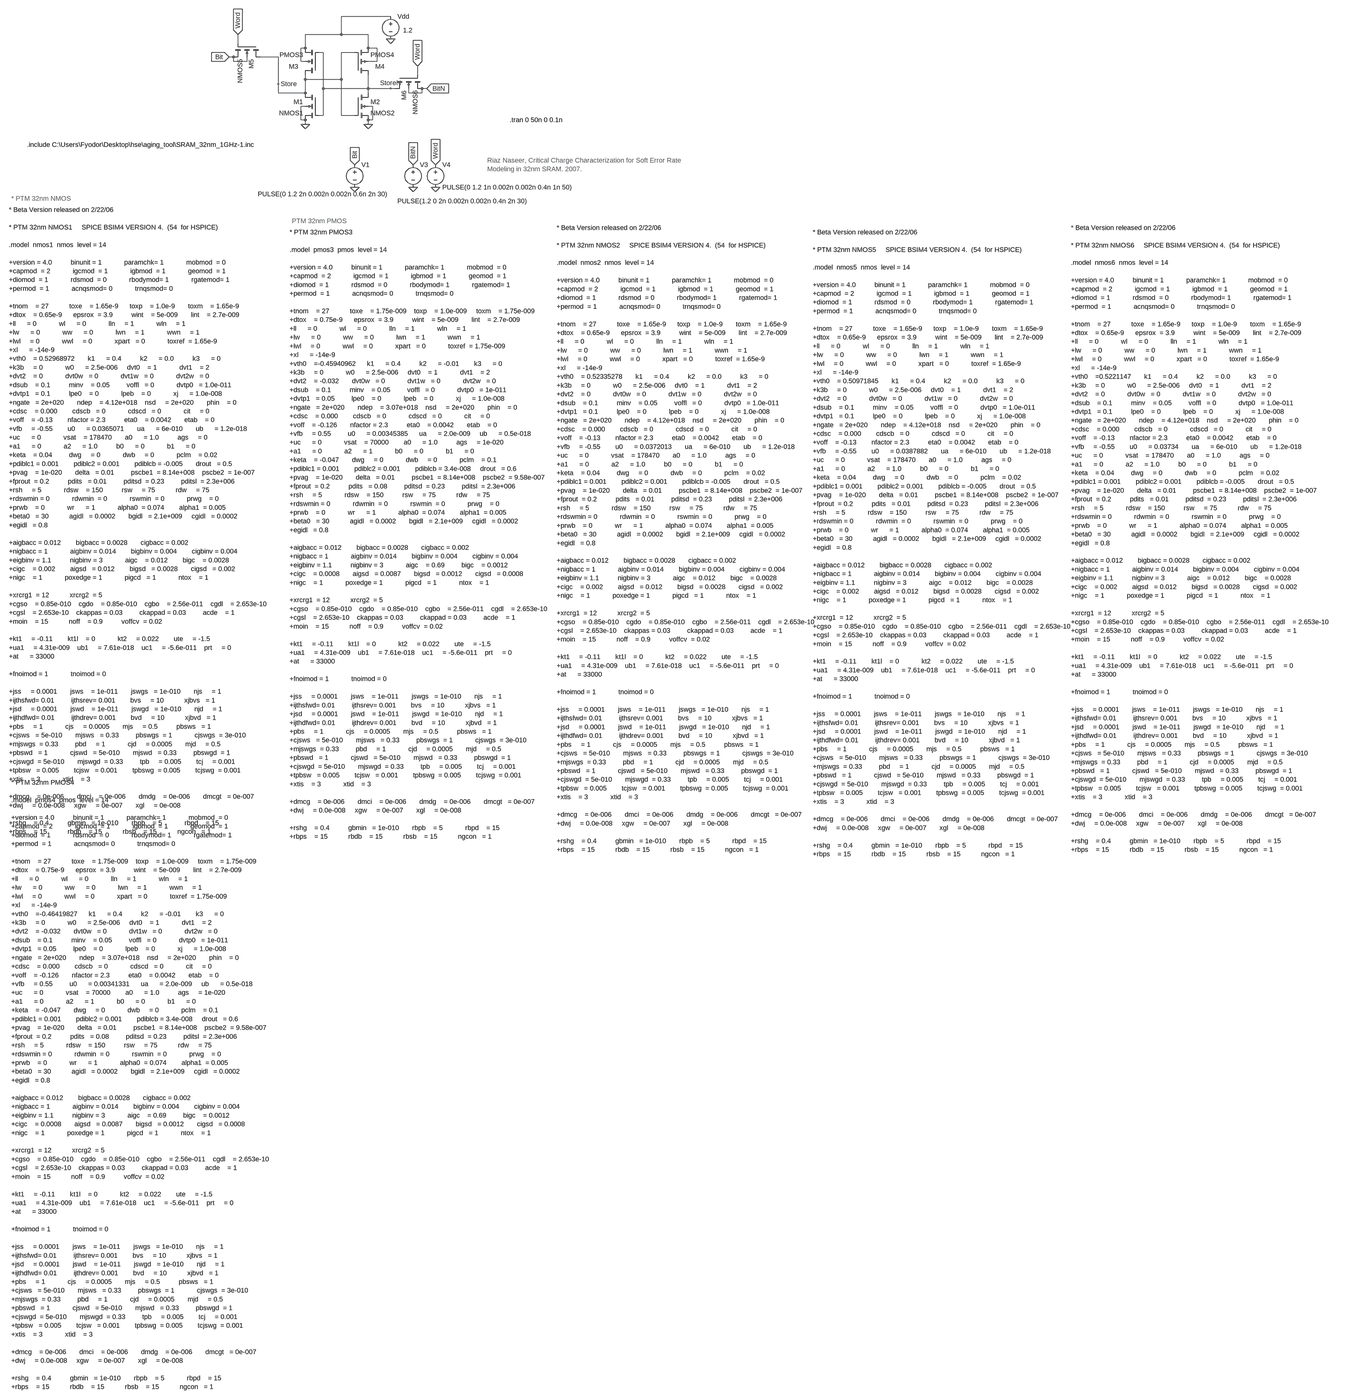
[diagram p0: schematic SRAM_32nm_1GHz_1V.asc, whole sheet]
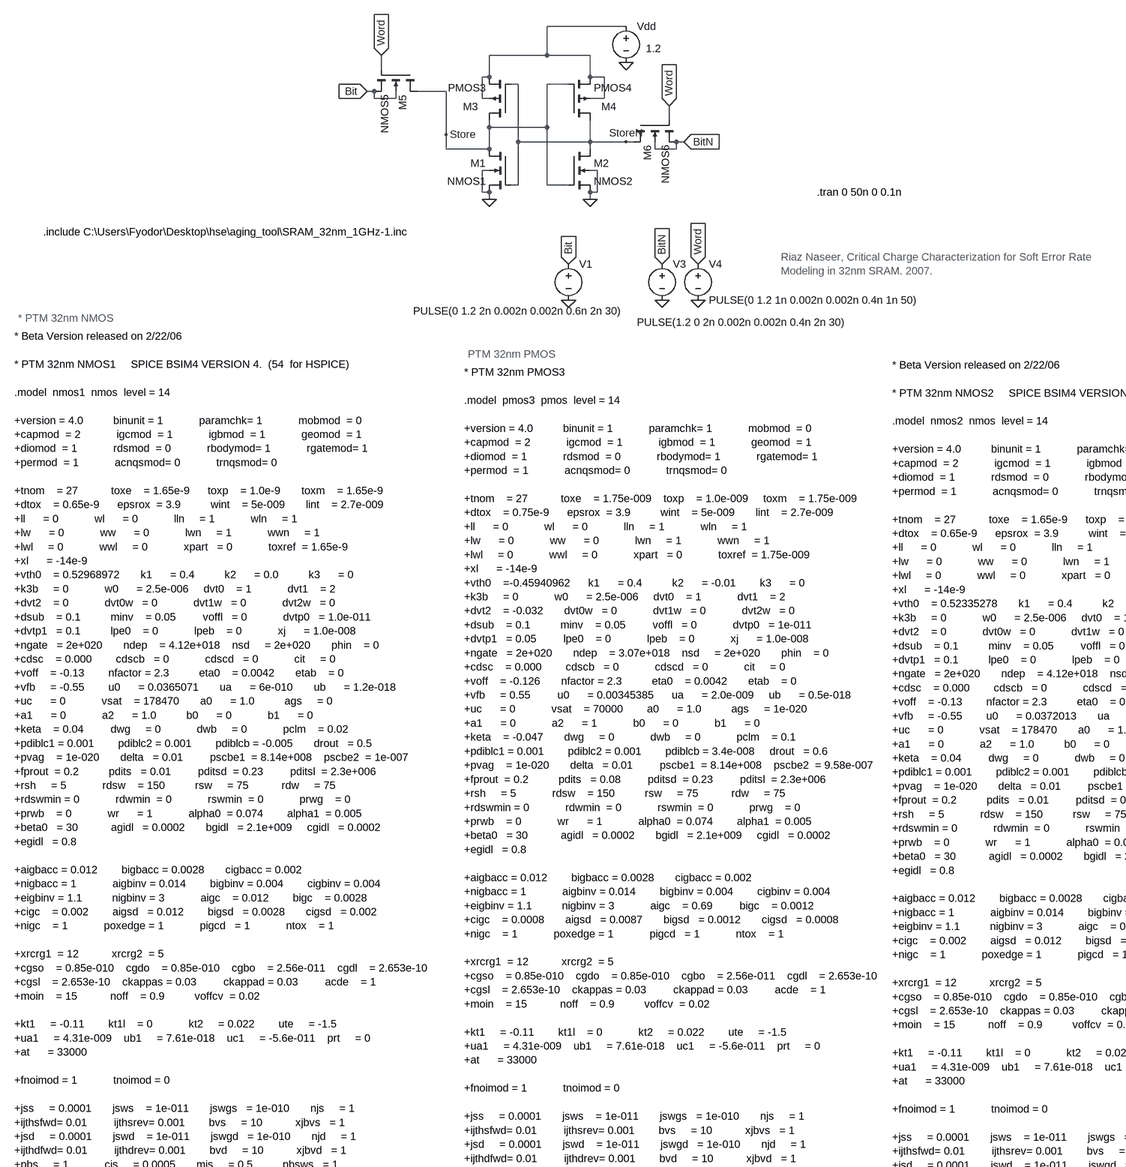
[diagram p1: schematic SRAM_32nm_1GHz_1V.asc, part, row 1 of 2, column 1 of 2]
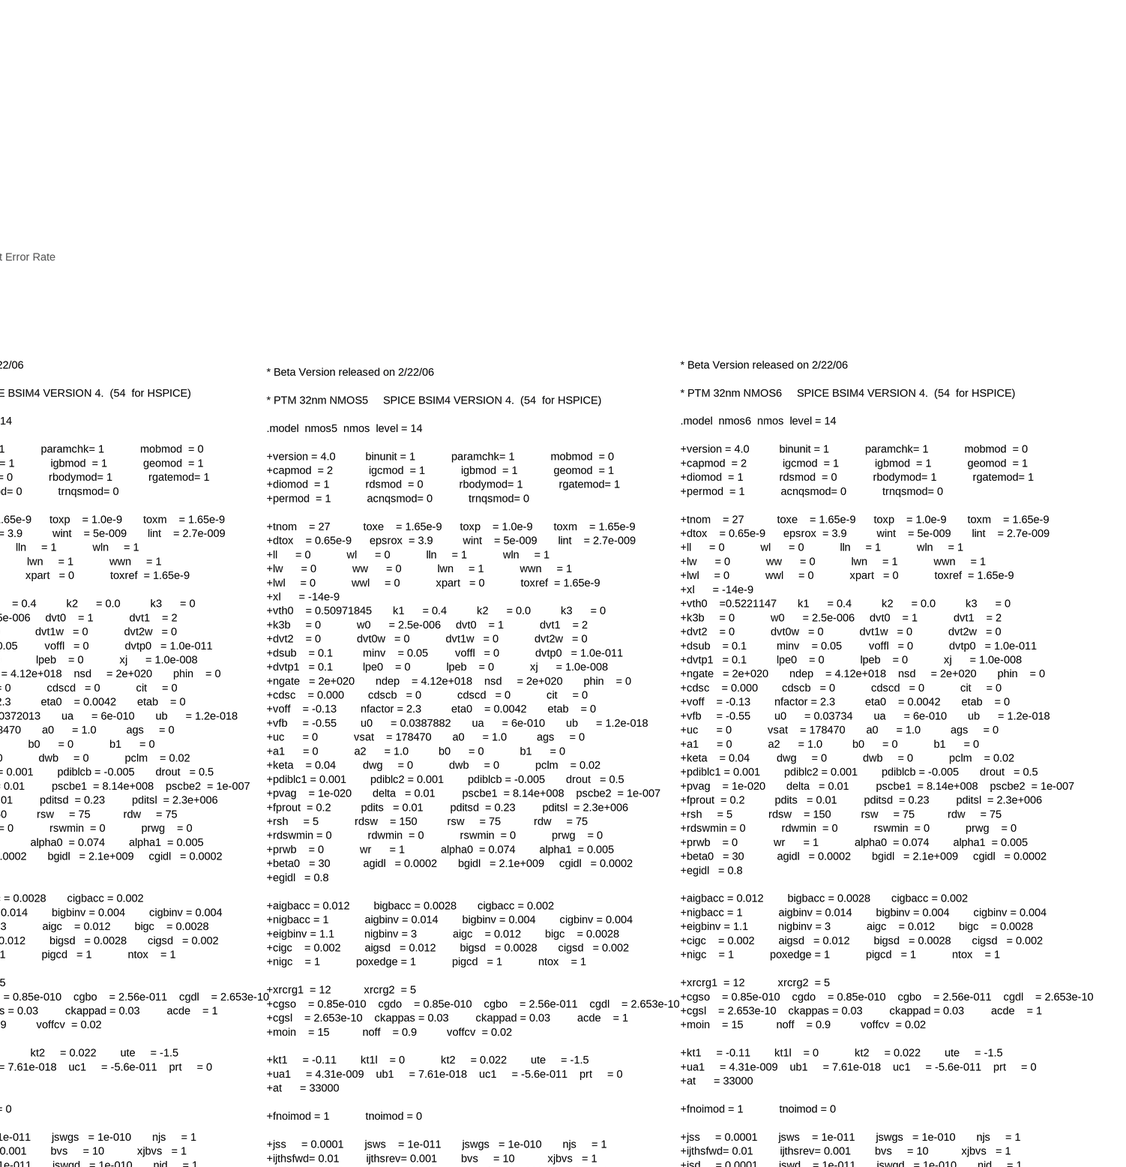
[diagram p2: schematic SRAM_32nm_1GHz_1V.asc, part, row 1 of 2, column 2 of 2]
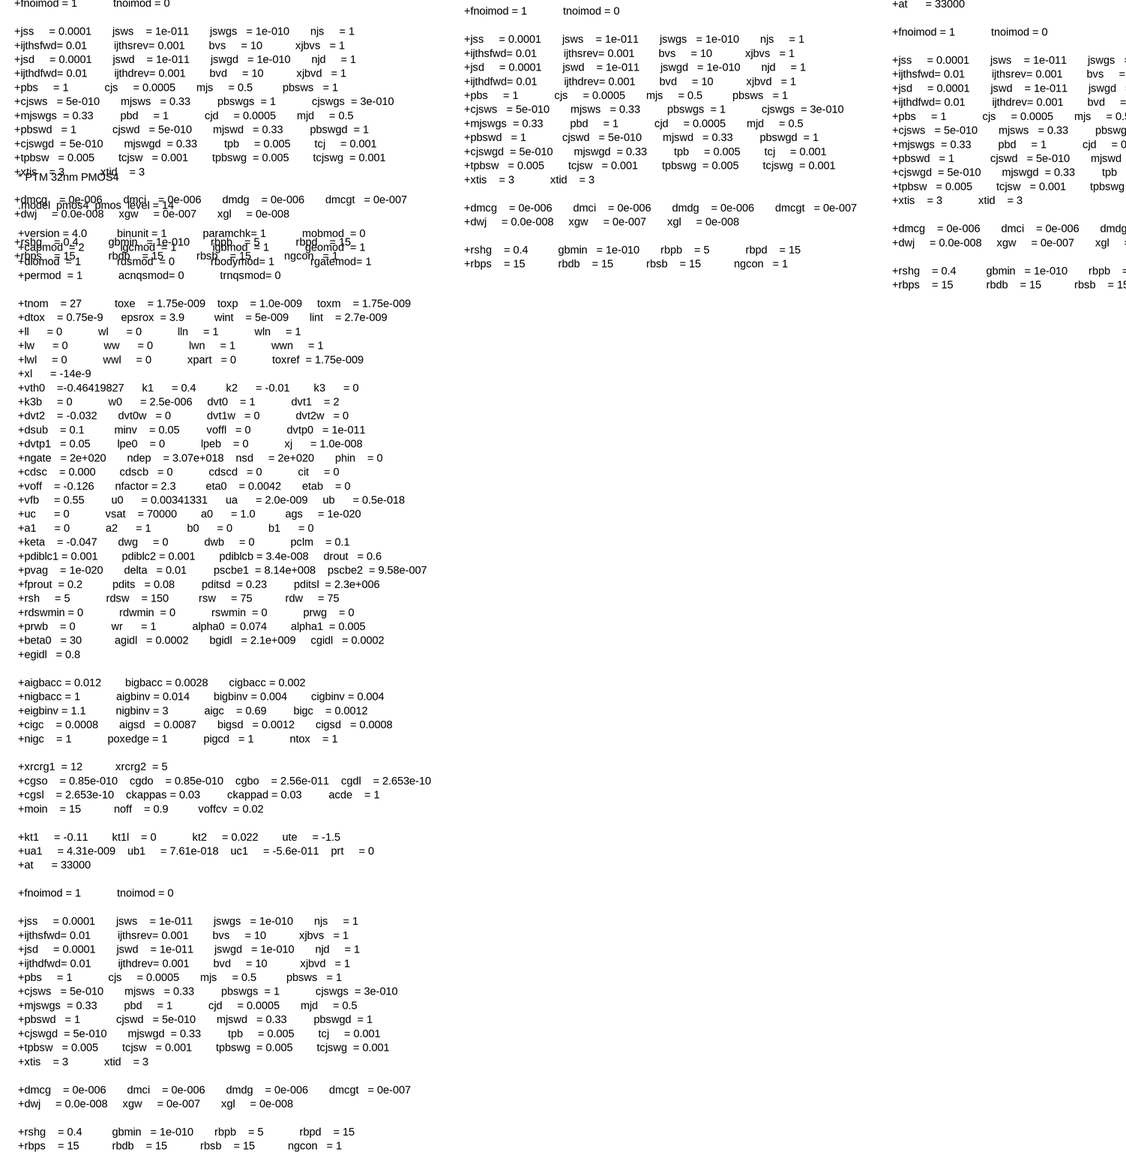
[diagram p3: schematic SRAM_32nm_1GHz_1V.asc, part, row 2 of 2, column 1 of 2]
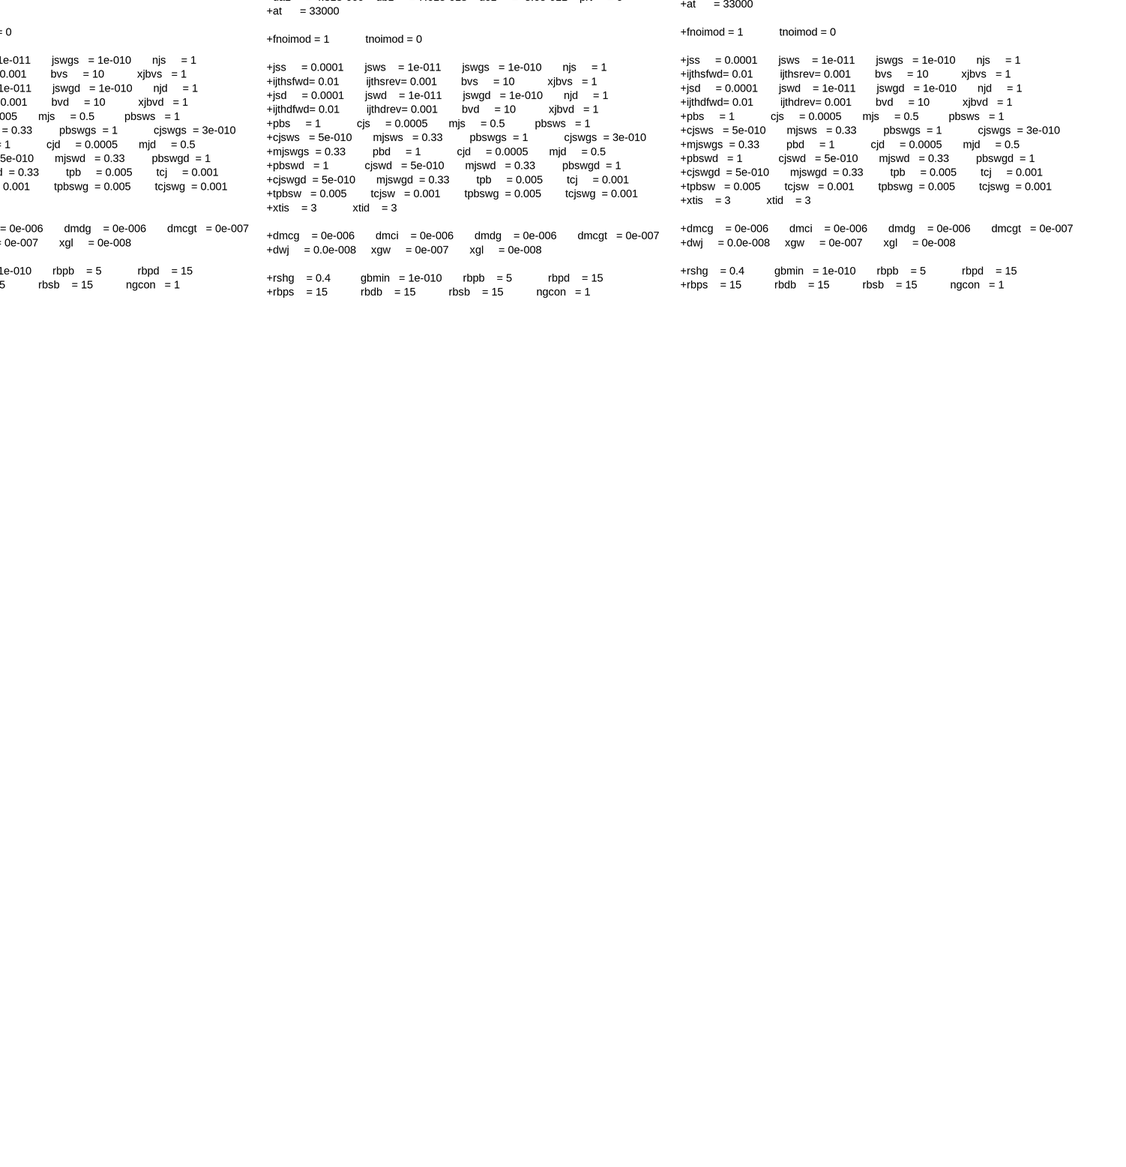
[diagram p4: schematic SRAM_32nm_1GHz_1V.asc, part, row 2 of 2, column 2 of 2]
* SRAM_32nm_1GHz_1V.asc
V1 Bit 0 PULSE(0 1.2 2n 0.002n 0.002n 0.6n 2n 30)
V3 BitN 0 PULSE(1.2 0 2n 0.002n 0.002n 0.4n 2n 30)
V4 Word 0 PULSE(0 1.2 1n 0.002n 0.002n 0.4n 1n 50)
M6 StoreN Word BitN BitN NMOS6 l=32n w=48n ad=0.049e-13 as=0.049e-13 pd=0.3e-6 ps=0.3e-6 m=1
M5 Store Word Bit Bit NMOS5 l=32n w=48n ad=0.049e-13 as=0.049e-13 pd=0.3.e-6 ps=0.3e-6 m=1
M2 StoreN Store 0 0 NMOS2 l=32n w=48n ad=0.049e-13 as=0.049e-13 pd=0.3e-6 ps=0.3e-6 m=1
M1 Store StoreN 0 0 NMOS1 l=32n w=48n ad=0.049e-13 as=0.049e-13 pd=0.3e-6 ps=0.3e-6 m=1
M4 StoreN Store N001 N001 PMOS4 l=32n w=0.15e-6 ad=0.144e-13 as=0.144e-13 pd=0.492e-6 ps=0.492e-6 m=1
M3 Store StoreN N001 N001 PMOS3 l=32n w=0.15e-6 ad=0.144e-13 as=0.144e-13 pd=0.492e-6 ps=0.492e-6 m=1
Vdd N001 0 1.2
.model NMOS NMOS
.model PMOS PMOS
.lib standard.mos
* PTM 32nm PMOS3
.model  pmos3  pmos  level = 14
+version = 4.0          binunit = 1            paramchk= 1            mobmod  = 0
+capmod  = 2            igcmod  = 1            igbmod  = 1            geomod  = 1
+diomod  = 1            rdsmod  = 0            rbodymod= 1            rgatemod= 1
+permod  = 1            acnqsmod= 0            trnqsmod= 0
+tnom    = 27           toxe    = 1.75e-009    toxp    = 1.0e-009     toxm    = 1.75e-009
+dtox    = 0.75e-9      epsrox  = 3.9          wint    = 5e-009       lint    = 2.7e-009
+ll      = 0            wl      = 0            lln     = 1            wln     = 1
+lw      = 0            ww      = 0            lwn     = 1            wwn     = 1
+lwl     = 0            wwl     = 0            xpart   = 0            toxref  = 1.75e-009
+xl      = -14e-9
+vth0    =-0.45940962      k1      = 0.4          k2      = -0.01        k3      = 0
+k3b     = 0            w0      = 2.5e-006     dvt0    = 1            dvt1    = 2
+dvt2    = -0.032       dvt0w   = 0            dvt1w   = 0            dvt2w   = 0
+dsub    = 0.1          minv    = 0.05         voffl   = 0            dvtp0   = 1e-011
+dvtp1   = 0.05         lpe0    = 0            lpeb    = 0            xj      = 1.0e-008
+ngate   = 2e+020       ndep    = 3.07e+018    nsd     = 2e+020       phin    = 0
+cdsc    = 0.000        cdscb   = 0            cdscd   = 0            cit     = 0
+voff    = -0.126       nfactor = 2.3          eta0    = 0.0042       etab    = 0
+vfb     = 0.55         u0      = 0.00345385      ua      = 2.0e-009     ub      = 0.5e-018
+uc      = 0            vsat    = 70000        a0      = 1.0          ags     = 1e-020
+a1      = 0            a2      = 1            b0      = 0            b1      = 0
+keta    = -0.047       dwg     = 0            dwb     = 0            pclm    = 0.1
+pdiblc1 = 0.001        pdiblc2 = 0.001        pdiblcb = 3.4e-008     drout   = 0.6
+pvag    = 1e-020       delta   = 0.01         pscbe1  = 8.14e+008    pscbe2  = 9.58e-007
+fprout  = 0.2          pdits   = 0.08         pditsd  = 0.23         pditsl  = 2.3e+006
+rsh     = 5            rdsw    = 150          rsw     = 75           rdw     = 75
+rdswmin = 0            rdwmin  = 0            rswmin  = 0            prwg    = 0
+prwb    = 0            wr      = 1            alpha0  = 0.074        alpha1  = 0.005
+beta0   = 30           agidl   = 0.0002       bgidl   = 2.1e+009     cgidl   = 0.0002
+egidl   = 0.8
+aigbacc = 0.012        bigbacc = 0.0028       cigbacc = 0.002
+nigbacc = 1            aigbinv = 0.014        bigbinv = 0.004        cigbinv = 0.004
+eigbinv = 1.1          nigbinv = 3            aigc    = 0.69         bigc    = 0.0012
+cigc    = 0.0008       aigsd   = 0.0087       bigsd   = 0.0012       cigsd   = 0.0008
+nigc    = 1            poxedge = 1            pigcd   = 1            ntox    = 1
+xrcrg1  = 12           xrcrg2  = 5
+cgso    = 0.85e-010    cgdo    = 0.85e-010    cgbo    = 2.56e-011    cgdl    = 2.653e-10
+cgsl    = 2.653e-10    ckappas = 0.03         ckappad = 0.03         acde    = 1
+moin    = 15           noff    = 0.9          voffcv  = 0.02
+kt1     = -0.11        kt1l    = 0            kt2     = 0.022        ute     = -1.5
+ua1     = 4.31e-009    ub1     = 7.61e-018    uc1     = -5.6e-011    prt     = 0
+at      = 33000
+fnoimod = 1            tnoimod = 0
+jss     = 0.0001       jsws    = 1e-011       jswgs   = 1e-010       njs     = 1
+ijthsfwd= 0.01         ijthsrev= 0.001        bvs     = 10           xjbvs   = 1
+jsd     = 0.0001       jswd    = 1e-011       jswgd   = 1e-010       njd     = 1
+ijthdfwd= 0.01         ijthdrev= 0.001        bvd     = 10           xjbvd   = 1
+pbs     = 1            cjs     = 0.0005       mjs     = 0.5          pbsws   = 1
+cjsws   = 5e-010       mjsws   = 0.33         pbswgs  = 1            cjswgs  = 3e-010
+mjswgs  = 0.33         pbd     = 1            cjd     = 0.0005       mjd     = 0.5
+pbswd   = 1            cjswd   = 5e-010       mjswd   = 0.33         pbswgd  = 1
+cjswgd  = 5e-010       mjswgd  = 0.33         tpb     = 0.005        tcj     = 0.001
+tpbsw   = 0.005        tcjsw   = 0.001        tpbswg  = 0.005        tcjswg  = 0.001
+xtis    = 3            xtid    = 3
+dmcg    = 0e-006       dmci    = 0e-006       dmdg    = 0e-006       dmcgt   = 0e-007
+dwj     = 0.0e-008     xgw     = 0e-007       xgl     = 0e-008
+rshg    = 0.4          gbmin   = 1e-010       rbpb    = 5            rbpd    = 15
+rbps    = 15           rbdb    = 15           rbsb    = 15           ngcon   = 1
* Beta Version released on 2/22/06
* PTM 32nm NMOS1     SPICE BSIM4 VERSION 4.  (54  for HSPICE)
.model  nmos1  nmos  level = 14
+version = 4.0          binunit = 1            paramchk= 1            mobmod  = 0
+capmod  = 2            igcmod  = 1            igbmod  = 1            geomod  = 1
+diomod  = 1            rdsmod  = 0            rbodymod= 1            rgatemod= 1
+permod  = 1            acnqsmod= 0            trnqsmod= 0
+tnom    = 27           toxe    = 1.65e-9      toxp    = 1.0e-9       toxm    = 1.65e-9
+dtox    = 0.65e-9      epsrox  = 3.9          wint    = 5e-009       lint    = 2.7e-009
+ll      = 0            wl      = 0            lln     = 1            wln     = 1
+lw      = 0            ww      = 0            lwn     = 1            wwn     = 1
+lwl     = 0            wwl     = 0            xpart   = 0            toxref  = 1.65e-9
+xl      = -14e-9
+vth0    = 0.52968972       k1      = 0.4          k2      = 0.0          k3      = 0
+k3b     = 0            w0      = 2.5e-006     dvt0    = 1            dvt1    = 2
+dvt2    = 0            dvt0w   = 0            dvt1w   = 0            dvt2w   = 0
+dsub    = 0.1          minv    = 0.05         voffl   = 0            dvtp0   = 1.0e-011
+dvtp1   = 0.1          lpe0    = 0            lpeb    = 0            xj      = 1.0e-008
+ngate   = 2e+020       ndep    = 4.12e+018    nsd     = 2e+020       phin    = 0
+cdsc    = 0.000        cdscb   = 0            cdscd   = 0            cit     = 0
+voff    = -0.13        nfactor = 2.3          eta0    = 0.0042       etab    = 0
+vfb     = -0.55        u0      = 0.0365071       ua      = 6e-010       ub      = 1.2e-018
+uc      = 0            vsat    = 178470       a0      = 1.0          ags     = 0
+a1      = 0            a2      = 1.0          b0      = 0            b1      = 0
+keta    = 0.04         dwg     = 0            dwb     = 0            pclm    = 0.02
+pdiblc1 = 0.001        pdiblc2 = 0.001        pdiblcb = -0.005       drout   = 0.5
+pvag    = 1e-020       delta   = 0.01         pscbe1  = 8.14e+008    pscbe2  = 1e-007
+fprout  = 0.2          pdits   = 0.01         pditsd  = 0.23         pditsl  = 2.3e+006
+rsh     = 5            rdsw    = 150          rsw     = 75           rdw     = 75
+rdswmin = 0            rdwmin  = 0            rswmin  = 0            prwg    = 0
+prwb    = 0            wr      = 1            alpha0  = 0.074        alpha1  = 0.005
+beta0   = 30           agidl   = 0.0002       bgidl   = 2.1e+009     cgidl   = 0.0002
+egidl   = 0.8
+aigbacc = 0.012        bigbacc = 0.0028       cigbacc = 0.002
+nigbacc = 1            aigbinv = 0.014        bigbinv = 0.004        cigbinv = 0.004
+eigbinv = 1.1          nigbinv = 3            aigc    = 0.012        bigc    = 0.0028
+cigc    = 0.002        aigsd   = 0.012        bigsd   = 0.0028       cigsd   = 0.002
+nigc    = 1            poxedge = 1            pigcd   = 1            ntox    = 1
+xrcrg1  = 12           xrcrg2  = 5
+cgso    = 0.85e-010    cgdo    = 0.85e-010    cgbo    = 2.56e-011    cgdl    = 2.653e-10
+cgsl    = 2.653e-10    ckappas = 0.03         ckappad = 0.03         acde    = 1
+moin    = 15           noff    = 0.9          voffcv  = 0.02
+kt1     = -0.11        kt1l    = 0            kt2     = 0.022        ute     = -1.5
+ua1     = 4.31e-009    ub1     = 7.61e-018    uc1     = -5.6e-011    prt     = 0
+at      = 33000
+fnoimod = 1            tnoimod = 0
+jss     = 0.0001       jsws    = 1e-011       jswgs   = 1e-010       njs     = 1
+ijthsfwd= 0.01         ijthsrev= 0.001        bvs     = 10           xjbvs   = 1
+jsd     = 0.0001       jswd    = 1e-011       jswgd   = 1e-010       njd     = 1
+ijthdfwd= 0.01         ijthdrev= 0.001        bvd     = 10           xjbvd   = 1
+pbs     = 1            cjs     = 0.0005       mjs     = 0.5          pbsws   = 1
+cjsws   = 5e-010       mjsws   = 0.33         pbswgs  = 1            cjswgs  = 3e-010
+mjswgs  = 0.33         pbd     = 1            cjd     = 0.0005       mjd     = 0.5
+pbswd   = 1            cjswd   = 5e-010       mjswd   = 0.33         pbswgd  = 1
+cjswgd  = 5e-010       mjswgd  = 0.33         tpb     = 0.005        tcj     = 0.001
+tpbsw   = 0.005        tcjsw   = 0.001        tpbswg  = 0.005        tcjswg  = 0.001
+xtis    = 3            xtid    = 3
+dmcg    = 0e-006       dmci    = 0e-006       dmdg    = 0e-006       dmcgt   = 0e-007
+dwj     = 0.0e-008     xgw     = 0e-007       xgl     = 0e-008
+rshg    = 0.4          gbmin   = 1e-010       rbpb    = 5            rbpd    = 15
+rbps    = 15           rbdb    = 15           rbsb    = 15           ngcon   = 1
* PTM 32nm PMOS
* * PTM 32nm NMOS
* Riaz Naseer, Critical Charge Characterization for Soft Error Rate
* Modeling in 32nm SRAM. 2007.
.tran 0 50n 0 0.1n
* Beta Version released on 2/22/06
* PTM 32nm NMOS2     SPICE BSIM4 VERSION 4.  (54  for HSPICE)
.model  nmos2  nmos  level = 14
+version = 4.0          binunit = 1            paramchk= 1            mobmod  = 0
+capmod  = 2            igcmod  = 1            igbmod  = 1            geomod  = 1
+diomod  = 1            rdsmod  = 0            rbodymod= 1            rgatemod= 1
+permod  = 1            acnqsmod= 0            trnqsmod= 0
+tnom    = 27           toxe    = 1.65e-9      toxp    = 1.0e-9       toxm    = 1.65e-9
+dtox    = 0.65e-9      epsrox  = 3.9          wint    = 5e-009       lint    = 2.7e-009
+ll      = 0            wl      = 0            lln     = 1            wln     = 1
+lw      = 0            ww      = 0            lwn     = 1            wwn     = 1
+lwl     = 0            wwl     = 0            xpart   = 0            toxref  = 1.65e-9
+xl      = -14e-9
+vth0    = 0.52335278       k1      = 0.4          k2      = 0.0          k3      = 0
+k3b     = 0            w0      = 2.5e-006     dvt0    = 1            dvt1    = 2
+dvt2    = 0            dvt0w   = 0            dvt1w   = 0            dvt2w   = 0
+dsub    = 0.1          minv    = 0.05         voffl   = 0            dvtp0   = 1.0e-011
+dvtp1   = 0.1          lpe0    = 0            lpeb    = 0            xj      = 1.0e-008
+ngate   = 2e+020       ndep    = 4.12e+018    nsd     = 2e+020       phin    = 0
+cdsc    = 0.000        cdscb   = 0            cdscd   = 0            cit     = 0
+voff    = -0.13        nfactor = 2.3          eta0    = 0.0042       etab    = 0
+vfb     = -0.55        u0      = 0.0372013       ua      = 6e-010       ub      = 1.2e-018
+uc      = 0            vsat    = 178470       a0      = 1.0          ags     = 0
+a1      = 0            a2      = 1.0          b0      = 0            b1      = 0
+keta    = 0.04         dwg     = 0            dwb     = 0            pclm    = 0.02
+pdiblc1 = 0.001        pdiblc2 = 0.001        pdiblcb = -0.005       drout   = 0.5
+pvag    = 1e-020       delta   = 0.01         pscbe1  = 8.14e+008    pscbe2  = 1e-007
+fprout  = 0.2          pdits   = 0.01         pditsd  = 0.23         pditsl  = 2.3e+006
+rsh     = 5            rdsw    = 150          rsw     = 75           rdw     = 75
+rdswmin = 0            rdwmin  = 0            rswmin  = 0            prwg    = 0
+prwb    = 0            wr      = 1            alpha0  = 0.074        alpha1  = 0.005
+beta0   = 30           agidl   = 0.0002       bgidl   = 2.1e+009     cgidl   = 0.0002
+egidl   = 0.8
+aigbacc = 0.012        bigbacc = 0.0028       cigbacc = 0.002
+nigbacc = 1            aigbinv = 0.014        bigbinv = 0.004        cigbinv = 0.004
+eigbinv = 1.1          nigbinv = 3            aigc    = 0.012        bigc    = 0.0028
+cigc    = 0.002        aigsd   = 0.012        bigsd   = 0.0028       cigsd   = 0.002
+nigc    = 1            poxedge = 1            pigcd   = 1            ntox    = 1
+xrcrg1  = 12           xrcrg2  = 5
+cgso    = 0.85e-010    cgdo    = 0.85e-010    cgbo    = 2.56e-011    cgdl    = 2.653e-10
+cgsl    = 2.653e-10    ckappas = 0.03         ckappad = 0.03         acde    = 1
+moin    = 15           noff    = 0.9          voffcv  = 0.02
+kt1     = -0.11        kt1l    = 0            kt2     = 0.022        ute     = -1.5
+ua1     = 4.31e-009    ub1     = 7.61e-018    uc1     = -5.6e-011    prt     = 0
+at      = 33000
+fnoimod = 1            tnoimod = 0
+jss     = 0.0001       jsws    = 1e-011       jswgs   = 1e-010       njs     = 1
+ijthsfwd= 0.01         ijthsrev= 0.001        bvs     = 10           xjbvs   = 1
+jsd     = 0.0001       jswd    = 1e-011       jswgd   = 1e-010       njd     = 1
+ijthdfwd= 0.01         ijthdrev= 0.001        bvd     = 10           xjbvd   = 1
+pbs     = 1            cjs     = 0.0005       mjs     = 0.5          pbsws   = 1
+cjsws   = 5e-010       mjsws   = 0.33         pbswgs  = 1            cjswgs  = 3e-010
+mjswgs  = 0.33         pbd     = 1            cjd     = 0.0005       mjd     = 0.5
+pbswd   = 1            cjswd   = 5e-010       mjswd   = 0.33         pbswgd  = 1
+cjswgd  = 5e-010       mjswgd  = 0.33         tpb     = 0.005        tcj     = 0.001
+tpbsw   = 0.005        tcjsw   = 0.001        tpbswg  = 0.005        tcjswg  = 0.001
+xtis    = 3            xtid    = 3
+dmcg    = 0e-006       dmci    = 0e-006       dmdg    = 0e-006       dmcgt   = 0e-007
+dwj     = 0.0e-008     xgw     = 0e-007       xgl     = 0e-008
+rshg    = 0.4          gbmin   = 1e-010       rbpb    = 5            rbpd    = 15
+rbps    = 15           rbdb    = 15           rbsb    = 15           ngcon   = 1
* Beta Version released on 2/22/06
* PTM 32nm NMOS5     SPICE BSIM4 VERSION 4.  (54  for HSPICE)
.model  nmos5  nmos  level = 14
+version = 4.0          binunit = 1            paramchk= 1            mobmod  = 0
+capmod  = 2            igcmod  = 1            igbmod  = 1            geomod  = 1
+diomod  = 1            rdsmod  = 0            rbodymod= 1            rgatemod= 1
+permod  = 1            acnqsmod= 0            trnqsmod= 0
+tnom    = 27           toxe    = 1.65e-9      toxp    = 1.0e-9       toxm    = 1.65e-9
+dtox    = 0.65e-9      epsrox  = 3.9          wint    = 5e-009       lint    = 2.7e-009
+ll      = 0            wl      = 0            lln     = 1            wln     = 1
+lw      = 0            ww      = 0            lwn     = 1            wwn     = 1
+lwl     = 0            wwl     = 0            xpart   = 0            toxref  = 1.65e-9
+xl      = -14e-9
+vth0    = 0.50971845       k1      = 0.4          k2      = 0.0          k3      = 0
+k3b     = 0            w0      = 2.5e-006     dvt0    = 1            dvt1    = 2
+dvt2    = 0            dvt0w   = 0            dvt1w   = 0            dvt2w   = 0
+dsub    = 0.1          minv    = 0.05         voffl   = 0            dvtp0   = 1.0e-011
+dvtp1   = 0.1          lpe0    = 0            lpeb    = 0            xj      = 1.0e-008
+ngate   = 2e+020       ndep    = 4.12e+018    nsd     = 2e+020       phin    = 0
+cdsc    = 0.000        cdscb   = 0            cdscd   = 0            cit     = 0
+voff    = -0.13        nfactor = 2.3          eta0    = 0.0042       etab    = 0
+vfb     = -0.55        u0      = 0.0387882       ua      = 6e-010       ub      = 1.2e-018
+uc      = 0            vsat    = 178470       a0      = 1.0          ags     = 0
+a1      = 0            a2      = 1.0          b0      = 0            b1      = 0
+keta    = 0.04         dwg     = 0            dwb     = 0            pclm    = 0.02
+pdiblc1 = 0.001        pdiblc2 = 0.001        pdiblcb = -0.005       drout   = 0.5
+pvag    = 1e-020       delta   = 0.01         pscbe1  = 8.14e+008    pscbe2  = 1e-007
+fprout  = 0.2          pdits   = 0.01         pditsd  = 0.23         pditsl  = 2.3e+006
+rsh     = 5            rdsw    = 150          rsw     = 75           rdw     = 75
+rdswmin = 0            rdwmin  = 0            rswmin  = 0            prwg    = 0
+prwb    = 0            wr      = 1            alpha0  = 0.074        alpha1  = 0.005
+beta0   = 30           agidl   = 0.0002       bgidl   = 2.1e+009     cgidl   = 0.0002
+egidl   = 0.8
+aigbacc = 0.012        bigbacc = 0.0028       cigbacc = 0.002
+nigbacc = 1            aigbinv = 0.014        bigbinv = 0.004        cigbinv = 0.004
+eigbinv = 1.1          nigbinv = 3            aigc    = 0.012        bigc    = 0.0028
+cigc    = 0.002        aigsd   = 0.012        bigsd   = 0.0028       cigsd   = 0.002
+nigc    = 1            poxedge = 1            pigcd   = 1            ntox    = 1
+xrcrg1  = 12           xrcrg2  = 5
+cgso    = 0.85e-010    cgdo    = 0.85e-010    cgbo    = 2.56e-011    cgdl    = 2.653e-10
+cgsl    = 2.653e-10    ckappas = 0.03         ckappad = 0.03         acde    = 1
+moin    = 15           noff    = 0.9          voffcv  = 0.02
+kt1     = -0.11        kt1l    = 0            kt2     = 0.022        ute     = -1.5
+ua1     = 4.31e-009    ub1     = 7.61e-018    uc1     = -5.6e-011    prt     = 0
+at      = 33000
+fnoimod = 1            tnoimod = 0
+jss     = 0.0001       jsws    = 1e-011       jswgs   = 1e-010       njs     = 1
+ijthsfwd= 0.01         ijthsrev= 0.001        bvs     = 10           xjbvs   = 1
+jsd     = 0.0001       jswd    = 1e-011       jswgd   = 1e-010       njd     = 1
+ijthdfwd= 0.01         ijthdrev= 0.001        bvd     = 10           xjbvd   = 1
+pbs     = 1            cjs     = 0.0005       mjs     = 0.5          pbsws   = 1
+cjsws   = 5e-010       mjsws   = 0.33         pbswgs  = 1            cjswgs  = 3e-010
+mjswgs  = 0.33         pbd     = 1            cjd     = 0.0005       mjd     = 0.5
+pbswd   = 1            cjswd   = 5e-010       mjswd   = 0.33         pbswgd  = 1
+cjswgd  = 5e-010       mjswgd  = 0.33         tpb     = 0.005        tcj     = 0.001
+tpbsw   = 0.005        tcjsw   = 0.001        tpbswg  = 0.005        tcjswg  = 0.001
+xtis    = 3            xtid    = 3
+dmcg    = 0e-006       dmci    = 0e-006       dmdg    = 0e-006       dmcgt   = 0e-007
+dwj     = 0.0e-008     xgw     = 0e-007       xgl     = 0e-008
+rshg    = 0.4          gbmin   = 1e-010       rbpb    = 5            rbpd    = 15
+rbps    = 15           rbdb    = 15           rbsb    = 15           ngcon   = 1
* Beta Version released on 2/22/06
* PTM 32nm NMOS6     SPICE BSIM4 VERSION 4.  (54  for HSPICE)
.model  nmos6  nmos  level = 14
+version = 4.0          binunit = 1            paramchk= 1            mobmod  = 0
+capmod  = 2            igcmod  = 1            igbmod  = 1            geomod  = 1
+diomod  = 1            rdsmod  = 0            rbodymod= 1            rgatemod= 1
+permod  = 1            acnqsmod= 0            trnqsmod= 0
+tnom    = 27           toxe    = 1.65e-9      toxp    = 1.0e-9       toxm    = 1.65e-9
+dtox    = 0.65e-9      epsrox  = 3.9          wint    = 5e-009       lint    = 2.7e-009
+ll      = 0            wl      = 0            lln     = 1            wln     = 1
+lw      = 0            ww      = 0            lwn     = 1            wwn     = 1
+lwl     = 0            wwl     = 0            xpart   = 0            toxref  = 1.65e-9
+xl      = -14e-9
+vth0    =0.5221147       k1      = 0.4          k2      = 0.0          k3      = 0
+k3b     = 0            w0      = 2.5e-006     dvt0    = 1            dvt1    = 2
+dvt2    = 0            dvt0w   = 0            dvt1w   = 0            dvt2w   = 0
+dsub    = 0.1          minv    = 0.05         voffl   = 0            dvtp0   = 1.0e-011
+dvtp1   = 0.1          lpe0    = 0            lpeb    = 0            xj      = 1.0e-008
+ngate   = 2e+020       ndep    = 4.12e+018    nsd     = 2e+020       phin    = 0
+cdsc    = 0.000        cdscb   = 0            cdscd   = 0            cit     = 0
+voff    = -0.13        nfactor = 2.3          eta0    = 0.0042       etab    = 0
+vfb     = -0.55        u0      = 0.03734       ua      = 6e-010       ub      = 1.2e-018
+uc      = 0            vsat    = 178470       a0      = 1.0          ags     = 0
+a1      = 0            a2      = 1.0          b0      = 0            b1      = 0
+keta    = 0.04         dwg     = 0            dwb     = 0            pclm    = 0.02
+pdiblc1 = 0.001        pdiblc2 = 0.001        pdiblcb = -0.005       drout   = 0.5
+pvag    = 1e-020       delta   = 0.01         pscbe1  = 8.14e+008    pscbe2  = 1e-007
+fprout  = 0.2          pdits   = 0.01         pditsd  = 0.23         pditsl  = 2.3e+006
+rsh     = 5            rdsw    = 150          rsw     = 75           rdw     = 75
+rdswmin = 0            rdwmin  = 0            rswmin  = 0            prwg    = 0
+prwb    = 0            wr      = 1            alpha0  = 0.074        alpha1  = 0.005
+beta0   = 30           agidl   = 0.0002       bgidl   = 2.1e+009     cgidl   = 0.0002
+egidl   = 0.8
+aigbacc = 0.012        bigbacc = 0.0028       cigbacc = 0.002
+nigbacc = 1            aigbinv = 0.014        bigbinv = 0.004        cigbinv = 0.004
+eigbinv = 1.1          nigbinv = 3            aigc    = 0.012        bigc    = 0.0028
+cigc    = 0.002        aigsd   = 0.012        bigsd   = 0.0028       cigsd   = 0.002
+nigc    = 1            poxedge = 1            pigcd   = 1            ntox    = 1
+xrcrg1  = 12           xrcrg2  = 5
+cgso    = 0.85e-010    cgdo    = 0.85e-010    cgbo    = 2.56e-011    cgdl    = 2.653e-10
+cgsl    = 2.653e-10    ckappas = 0.03         ckappad = 0.03         acde    = 1
+moin    = 15           noff    = 0.9          voffcv  = 0.02
+kt1     = -0.11        kt1l    = 0            kt2     = 0.022        ute     = -1.5
+ua1     = 4.31e-009    ub1     = 7.61e-018    uc1     = -5.6e-011    prt     = 0
+at      = 33000
+fnoimod = 1            tnoimod = 0
+jss     = 0.0001       jsws    = 1e-011       jswgs   = 1e-010       njs     = 1
+ijthsfwd= 0.01         ijthsrev= 0.001        bvs     = 10           xjbvs   = 1
+jsd     = 0.0001       jswd    = 1e-011       jswgd   = 1e-010       njd     = 1
+ijthdfwd= 0.01         ijthdrev= 0.001        bvd     = 10           xjbvd   = 1
+pbs     = 1            cjs     = 0.0005       mjs     = 0.5          pbsws   = 1
+cjsws   = 5e-010       mjsws   = 0.33         pbswgs  = 1            cjswgs  = 3e-010
+mjswgs  = 0.33         pbd     = 1            cjd     = 0.0005       mjd     = 0.5
+pbswd   = 1            cjswd   = 5e-010       mjswd   = 0.33         pbswgd  = 1
+cjswgd  = 5e-010       mjswgd  = 0.33         tpb     = 0.005        tcj     = 0.001
+tpbsw   = 0.005        tcjsw   = 0.001        tpbswg  = 0.005        tcjswg  = 0.001
+xtis    = 3            xtid    = 3
+dmcg    = 0e-006       dmci    = 0e-006       dmdg    = 0e-006       dmcgt   = 0e-007
+dwj     = 0.0e-008     xgw     = 0e-007       xgl     = 0e-008
+rshg    = 0.4          gbmin   = 1e-010       rbpb    = 5            rbpd    = 15
+rbps    = 15           rbdb    = 15           rbsb    = 15           ngcon   = 1
* PTM 32nm PMOS4
.model  pmos4  pmos  level = 14
+version = 4.0          binunit = 1            paramchk= 1            mobmod  = 0
+capmod  = 2            igcmod  = 1            igbmod  = 1            geomod  = 1
+diomod  = 1            rdsmod  = 0            rbodymod= 1            rgatemod= 1
+permod  = 1            acnqsmod= 0            trnqsmod= 0
+tnom    = 27           toxe    = 1.75e-009    toxp    = 1.0e-009     toxm    = 1.75e-009
+dtox    = 0.75e-9      epsrox  = 3.9          wint    = 5e-009       lint    = 2.7e-009
+ll      = 0            wl      = 0            lln     = 1            wln     = 1
+lw      = 0            ww      = 0            lwn     = 1            wwn     = 1
+lwl     = 0            wwl     = 0            xpart   = 0            toxref  = 1.75e-009
+xl      = -14e-9
+vth0    =-0.46419827      k1      = 0.4          k2      = -0.01        k3      = 0
+k3b     = 0            w0      = 2.5e-006     dvt0    = 1            dvt1    = 2
+dvt2    = -0.032       dvt0w   = 0            dvt1w   = 0            dvt2w   = 0
+dsub    = 0.1          minv    = 0.05         voffl   = 0            dvtp0   = 1e-011
+dvtp1   = 0.05         lpe0    = 0            lpeb    = 0            xj      = 1.0e-008
+ngate   = 2e+020       ndep    = 3.07e+018    nsd     = 2e+020       phin    = 0
+cdsc    = 0.000        cdscb   = 0            cdscd   = 0            cit     = 0
+voff    = -0.126       nfactor = 2.3          eta0    = 0.0042       etab    = 0
+vfb     = 0.55         u0      = 0.00341331      ua      = 2.0e-009     ub      = 0.5e-018
+uc      = 0            vsat    = 70000        a0      = 1.0          ags     = 1e-020
+a1      = 0            a2      = 1            b0      = 0            b1      = 0
+keta    = -0.047       dwg     = 0            dwb     = 0            pclm    = 0.1
+pdiblc1 = 0.001        pdiblc2 = 0.001        pdiblcb = 3.4e-008     drout   = 0.6
+pvag    = 1e-020       delta   = 0.01         pscbe1  = 8.14e+008    pscbe2  = 9.58e-007
+fprout  = 0.2          pdits   = 0.08         pditsd  = 0.23         pditsl  = 2.3e+006
+rsh     = 5            rdsw    = 150          rsw     = 75           rdw     = 75
+rdswmin = 0            rdwmin  = 0            rswmin  = 0            prwg    = 0
+prwb    = 0            wr      = 1            alpha0  = 0.074        alpha1  = 0.005
+beta0   = 30           agidl   = 0.0002       bgidl   = 2.1e+009     cgidl   = 0.0002
+egidl   = 0.8
+aigbacc = 0.012        bigbacc = 0.0028       cigbacc = 0.002
+nigbacc = 1            aigbinv = 0.014        bigbinv = 0.004        cigbinv = 0.004
+eigbinv = 1.1          nigbinv = 3            aigc    = 0.69         bigc    = 0.0012
+cigc    = 0.0008       aigsd   = 0.0087       bigsd   = 0.0012       cigsd   = 0.0008
+nigc    = 1            poxedge = 1            pigcd   = 1            ntox    = 1
+xrcrg1  = 12           xrcrg2  = 5
+cgso    = 0.85e-010    cgdo    = 0.85e-010    cgbo    = 2.56e-011    cgdl    = 2.653e-10
+cgsl    = 2.653e-10    ckappas = 0.03         ckappad = 0.03         acde    = 1
+moin    = 15           noff    = 0.9          voffcv  = 0.02
+kt1     = -0.11        kt1l    = 0            kt2     = 0.022        ute     = -1.5
+ua1     = 4.31e-009    ub1     = 7.61e-018    uc1     = -5.6e-011    prt     = 0
+at      = 33000
+fnoimod = 1            tnoimod = 0
+jss     = 0.0001       jsws    = 1e-011       jswgs   = 1e-010       njs     = 1
+ijthsfwd= 0.01         ijthsrev= 0.001        bvs     = 10           xjbvs   = 1
+jsd     = 0.0001       jswd    = 1e-011       jswgd   = 1e-010       njd     = 1
+ijthdfwd= 0.01         ijthdrev= 0.001        bvd     = 10           xjbvd   = 1
+pbs     = 1            cjs     = 0.0005       mjs     = 0.5          pbsws   = 1
+cjsws   = 5e-010       mjsws   = 0.33         pbswgs  = 1            cjswgs  = 3e-010
+mjswgs  = 0.33         pbd     = 1            cjd     = 0.0005       mjd     = 0.5
+pbswd   = 1            cjswd   = 5e-010       mjswd   = 0.33         pbswgd  = 1
+cjswgd  = 5e-010       mjswgd  = 0.33         tpb     = 0.005        tcj     = 0.001
+tpbsw   = 0.005        tcjsw   = 0.001        tpbswg  = 0.005        tcjswg  = 0.001
+xtis    = 3            xtid    = 3
+dmcg    = 0e-006       dmci    = 0e-006       dmdg    = 0e-006       dmcgt   = 0e-007
+dwj     = 0.0e-008     xgw     = 0e-007       xgl     = 0e-008
+rshg    = 0.4          gbmin   = 1e-010       rbpb    = 5            rbpd    = 15
+rbps    = 15           rbdb    = 15           rbsb    = 15           ngcon   = 1
.include C:\Users\Fyodor\Desktop\hse\aging_tool\SRAM_32nm_1GHz-1.inc
.backanno
.end